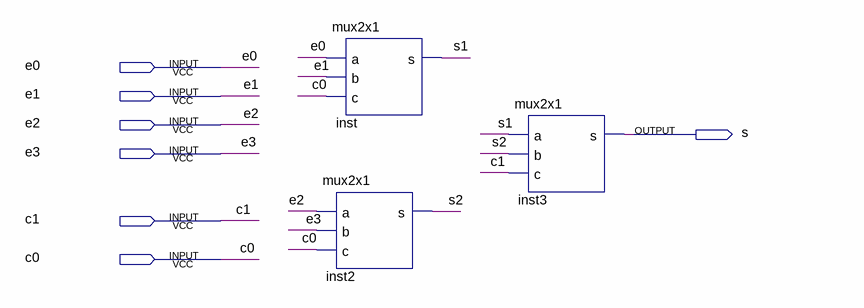
[diagram p0: schematic sheet]
// Quartus schematic mux4x1.bdf as structural Verilog: 3 symbols, 7 pins
module mux4x1 (
  input  e0,
  input  e1,
  input  e2,
  input  e3,
  input  c1,
  input  c0,
  output s
);

  wire s1, s2;

  mux2x1 inst2 (.a(e2), .b(e3), .c(c0), .s(s2));
  mux2x1 inst (.a(e0), .b(e1), .c(c0), .s(s1));
  mux2x1 inst3 (.a(s1), .b(s2), .c(c1), .s(s));
endmodule
